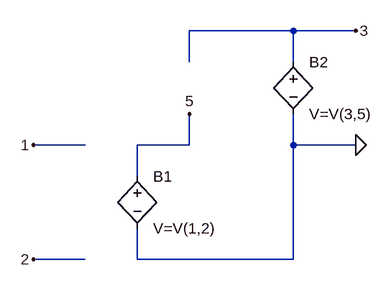
[diagram p0: schematic IdealOpamp.asc]
IdealOpamp.asc, the LTspice schematic file:
Version 4
SHEET 1 880 680
WIRE 496 -64 336 -64
WIRE 592 -64 496 -64
WIRE 336 -16 336 -64
WIRE 496 -16 496 -64
WIRE 176 112 96 112
WIRE 336 112 336 64
WIRE 336 112 256 112
WIRE 496 112 496 64
WIRE 592 112 496 112
WIRE 256 160 256 112
WIRE 176 288 96 288
WIRE 256 288 256 240
WIRE 496 288 496 112
WIRE 496 288 256 288
FLAG 96 112 1
FLAG 96 288 2
FLAG 336 64 5
FLAG 592 -64 3
FLAG 592 112 0
SYMBOL bv 256 144 R0
SYMATTR InstName B1
SYMATTR Value V=V(1,2)
SYMBOL bv 496 -32 R0
SYMATTR InstName B2
SYMATTR Value V=V(3,5)

The netlist it stands for:
* IdealOpamp.asc
B1 5 0 V=V(1,2)
B2 3 0 V=V(3,5)
.backanno
.end